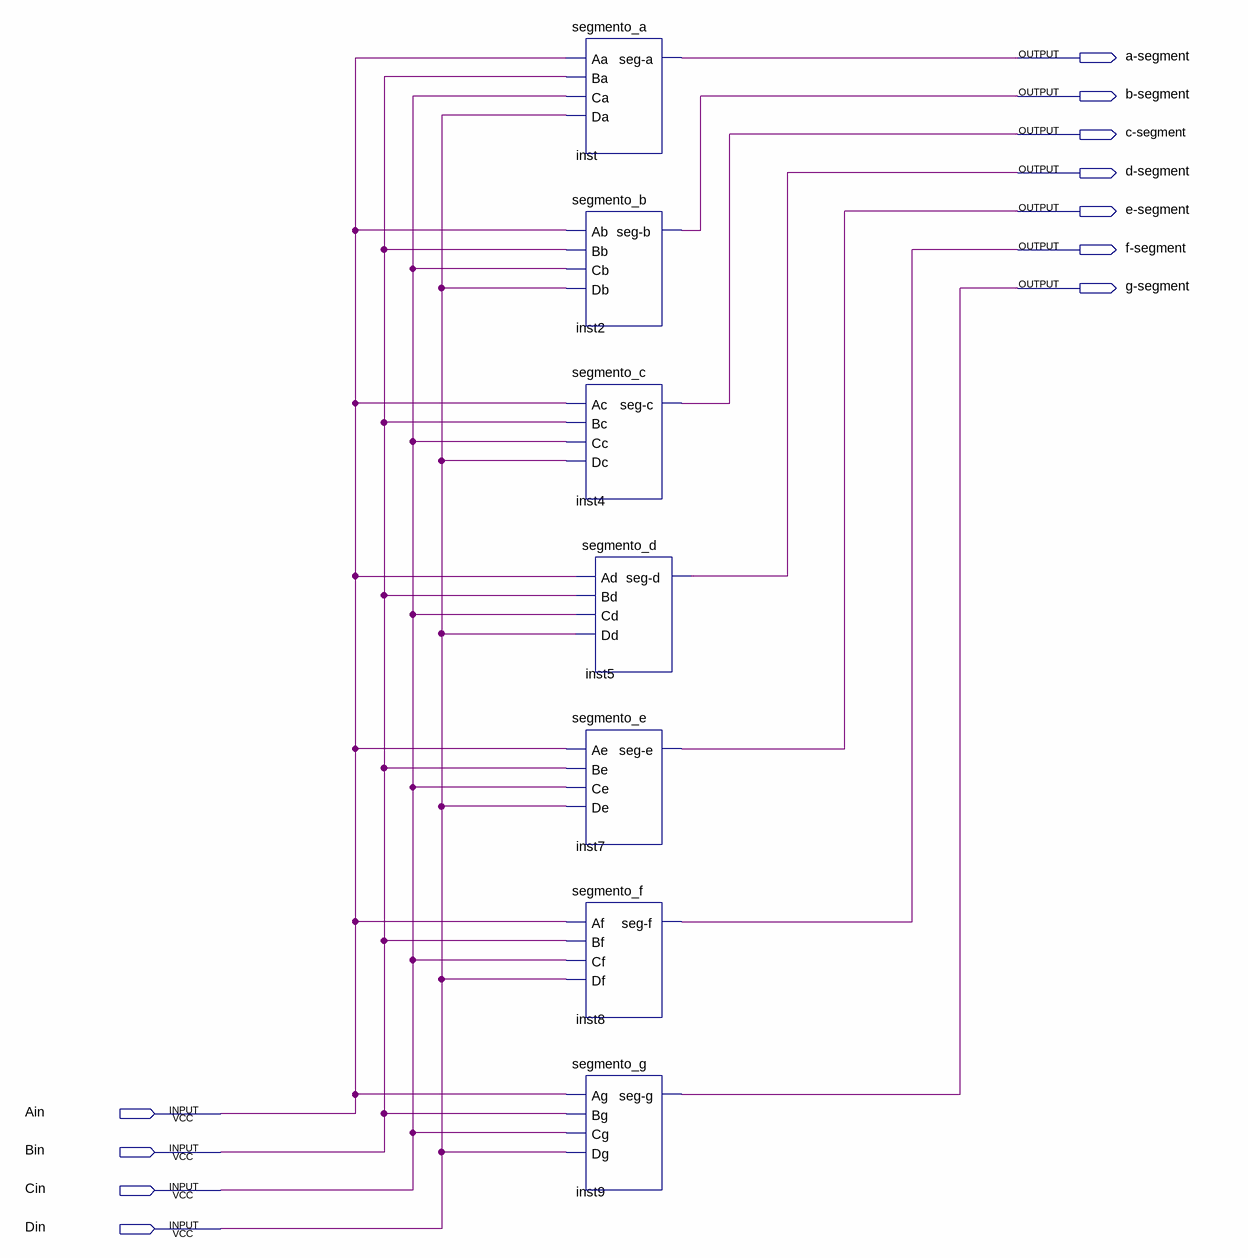
[diagram p0: schematic sheet]
// Quartus schematic conversor.bdf as structural Verilog: 7 symbols, 11 pins
module conversor (
  input  Ain,
  input  Bin,
  input  Cin,
  input  Din,
  output \a-segment ,
  output \b-segment ,
  output \c-segment ,
  output \d-segment ,
  output \e-segment ,
  output \f-segment ,
  output \g-segment 
);

  segmento_a inst (.Aa(Ain), .Ba(Bin), .Ca(Cin), .Da(Din), .\seg-a (\a-segment ));
  segmento_b inst2 (.Ab(Ain), .Bb(Bin), .Cb(Cin), .Db(Din), .\seg-b (\b-segment ));
  segmento_c inst4 (.Ac(Ain), .Bc(Bin), .Cc(Cin), .Dc(Din), .\seg-c (\c-segment ));
  segmento_d inst5 (.Ad(Ain), .Bd(Bin), .Cd(Cin), .Dd(Din), .\seg-d (\d-segment ));
  segmento_e inst7 (.Ae(Ain), .Be(Bin), .Ce(Cin), .De(Din), .\seg-e (\e-segment ));
  segmento_f inst8 (.Af(Ain), .Bf(Bin), .Cf(Cin), .Df(Din), .\seg-f (\f-segment ));
  segmento_g inst9 (.Ag(Ain), .Bg(Bin), .Cg(Cin), .Dg(Din), .\seg-g (\g-segment ));
endmodule
